# Altium schematic sheet mcu_node.SchDoc
size A3; SheetNumber: 2; SheetTotal: 2
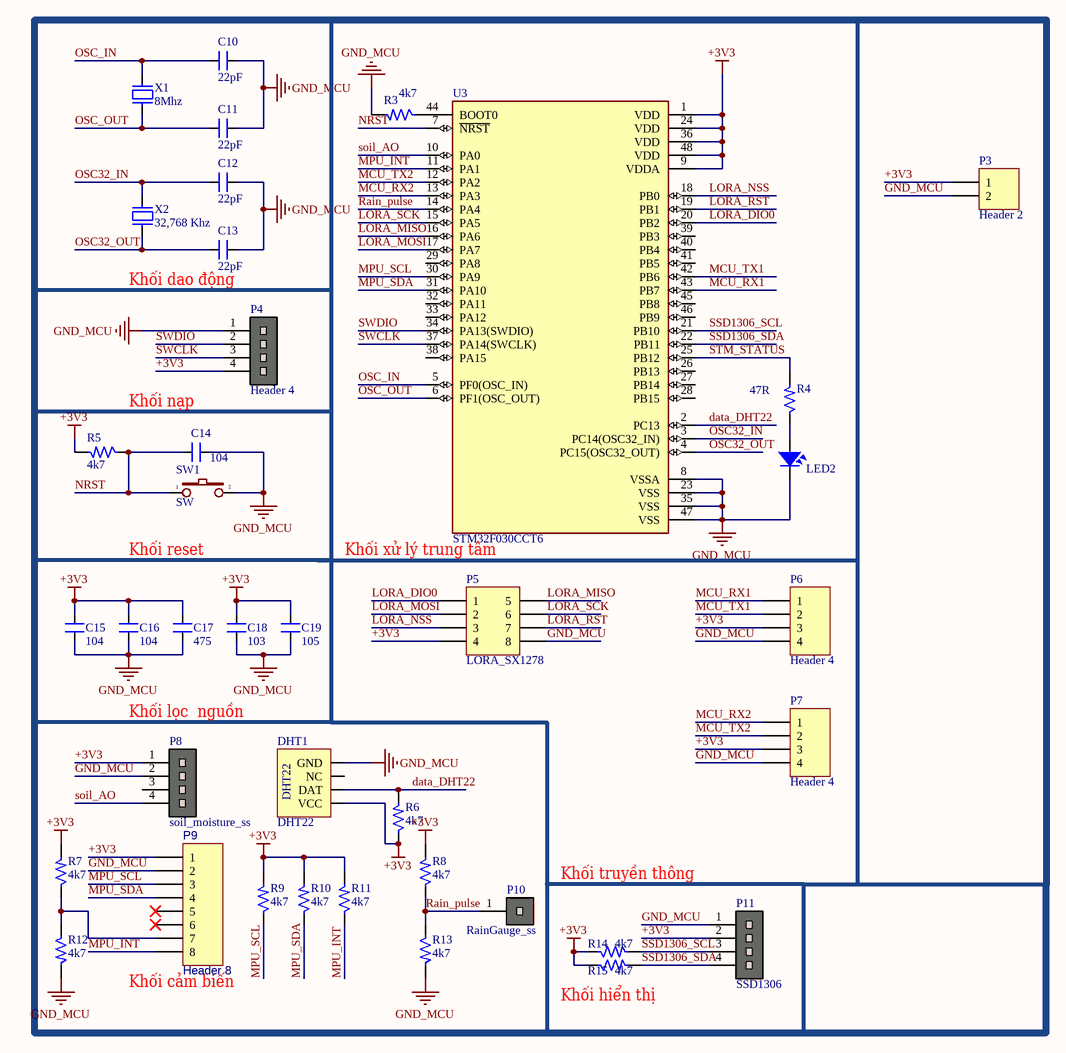
[diagram p0: mcu_node.SchDoc]

## Parts
C10  22pF  [SM-0805]
C11  22pF  [SM-0805]
C12  22pF  [SM-0805]
C13  22pF  [SM-0805]
C14  104  [SM-0805]
C15  104  [SM-0805]
C16  104  [SM-0805]
C17  475  [SM-0805]
C18  103  [SM-0805]
C19  105  [SM-0805]
DHT1  DHT22  [DHT22]
LED2  LED  [LED-0805-Green]  (value not drawn)
P3  Header 2  [HDR1X2]
P4  Header 4  [HDR 1X4]
P5  LORA_SX1278  [HDR2X4_CEN]
P6  Header 4  [HDR1X4]
P7  Header 4  [HDR1X4]
P8  soil_moisture_ss  [HDR 1X4]
P9  Header 8  [HDR1X8]
P10  RainGauge_ss  [HDR 1X1]
P11  SSD1306  [HDR 1X4]
R3  4k7  [R-0805]
R4  47R  [R-0805]
R5  4k7  [R-0805]
R6  4k7  [R-0805]
R7  4k7  [R-0805]
R8  4k7  [R-0805]
R9  4k7  [R-0805]
R10  4k7  [R-0805]
R11  4k7  [R-0805]
R12  4k7  [R-0805]
R13  4k7  [R-0805]
R14  4k7  [R-0805]
R15  4k7  [R-0805]
SW1  SW  [SW1-SMD]
U3  STM32F030CCT6  [QFP50P900X900X160-48N]
X1  8Mhz  [XT2]
X2  32,768 Khz  [XT32k]

## Nets
+3V3: C15.2 C16.2 C17.2 C18.2 C19.2 DHT1.1(VCC) P3.1 P4.4 P5.4 P6.3 P7.3 P8.1 P9.1 P11.2 R5.2 R6.1 R7.2 R8.2 R9.2 R10.2 R11.2 R14.1 R15.1 U3.1(VDD) U3.9(VDDA) U3.24(VDD) U3.36(VDD) U3.48(VDD)
GND_MCU: C10.1 C11.1 C12.1 C13.1 C14.2 C15.1 C16.1 C17.1 C18.1 C19.1 DHT1.4(GND) LED2.2 P3.2 P4.1 P5.8 P6.4 P7.4 P8.2 P9.2 P11.1 R3.2 R12.2 R13.2 SW1.2 U3.8(VSSA) U3.23(VSS) U3.35(VSS) U3.47(VSS)
data_DHT22: DHT1.2(DAT) R6.2 U3.2(PC13)
LORA_DIO0: P5.1 U3.20(PB2)
LORA_MISO: P5.5 U3.16(PA6)
LORA_MOSI: P5.2 U3.17(PA7)
LORA_NSS: P5.3 U3.18(PB0)
LORA_RST: P5.7 U3.19(PB1)
LORA_SCK: P5.6 U3.15(PA5)
MCU_RX1: P6.1 U3.43(PB7)
MCU_RX2: P7.1 U3.13(PA3)
MCU_TX1: P6.2 U3.42(PB6)
MCU_TX2: P7.2 U3.12(PA2)
MPU_INT: P9.8 R11.1 U3.11(PA1)
MPU_SCL: P9.3 R9.1 U3.30(PA9)
MPU_SDA: P9.4 R10.1 U3.31(PA10)
NRST: C14.1 R5.1 SW1.1 U3.7(~{NRST})
OSC32_IN: C12.2 U3.3(PC14(OSC32_IN)) X2.2
OSC32_OUT: C13.2 U3.4(PC15(OSC32_OUT)) X2.1
OSC_IN: C10.2 U3.5(PF0(OSC_IN)) X1.2
OSC_OUT: C11.2 U3.6(PF1(OSC_OUT)) X1.1
Rain_pulse: P10.1 R8.1 R13.1 U3.14(PA4)
soil_AO: P8.4 U3.10(PA0)
SSD1306_SCL: P11.3 R14.2 U3.21(PB10)
SSD1306_SDA: P11.4 R15.2 U3.22(PB11)
STM_STATUS: R4.2 U3.25(PB12)
SWCLK: P4.3 U3.37(PA14(SWCLK))
SWDIO: P4.2 U3.34(PA13(SWDIO))
NetLED2_1: LED2.1 R4.1
NetP9_7: P9.7 R7.1 R12.1
NetR3_1: R3.1 U3.44(BOOT0)

Not connected (* = marked no-connect by the designer): DHT1 3(NC); P8 3; P9 5* 6*; U3 26(PB13) 27(PB14) 28(PB15) 29(PA8) 32(PA11) 33(PA12) 38(PA15) 39(PB3) 40(PB4) 41(PB5) 45(PB8) 46(PB9)

## Notes on the sheet
- (near C13) Khối dao động
- Khối nạp
- Khối reset
- (near U3) Khối xử lý trung tâm
- (near P8) Khối lọc  nguồn
- Khối truyền thông
- (near P9) Khối cảm biến
- Khối hiển thị

## Library data of the parts
C10-C17 C19 = CM: Cap SMD; Value: 103
C18 = CM: Cap SMD; Value: 103
DHT1 = DHT22: Manufacturer: W¨¹rth Elektronik eiSos GmbH; partNo: 613004143121; ComponentLink1 Description: Manufacturer; ComponentLink2 Description: Datasheet; NoPins: 04; Created Date: 29 March 2013; ComponentLink1URL: http://www.we-online.com; ComponentLink2URL: http://katalog.we-online.de/em/datasheet/6130xx143121.pdf; Created by: Karrer Zheng
LED2 = LED SMD: Value: LED 3 - 5 ly 2 Colour
P3 = Header 2: Header, 2-Pin; LatestRevisionDate: 17-Jul-2002; LatestRevisionNote: Re-released for DXP Platform.; Publisher: Altium Limited
P4 P6-P8 P11 = Header 4: Header, 4-Pin
  P6 P7: LatestRevisionDate: 17-Jul-2002; LatestRevisionNote: Re-released for DXP Platform.; Publisher: Altium Limited
P5 = Header 4X2A: Header, 4-Pin, Dual row; LatestRevisionDate: 17-Jul-2002; LatestRevisionNote: Re-released for DXP Platform.; Publisher: Altium Limited
P9 = Header 8: Header, 8-Pin; LatestRevisionDate: 17-Jul-2002; LatestRevisionNote: Re-released for DXP Platform.; Publisher: Altium Limited
P10 = Header 1: Header, 1-Pin
R3-R15 = resistor: dien tro; value: 1k
SW1 = SW2: Switch button 2 pin; Value: SW chip 2 pin
U3 = STM32F030CCT6: ARMÂ® CortexÂ®-M0 STM32F0 Microcontroller IC 32-Bit 48MHz 256KB _256K x 8_ FLASH 48-LQFP _7x7_; MF: STMicroelectronics; Value: *; Digi-Key_Purchase_URL: https://www.digikey.com.ar/product-detail/en/stmicroelectronics/STM32F030CCT6TR/497-17332-2-ND/6833532?utm_source=snapeda&utm_medium=aggregator&utm_campaign=symbol; MP: STM32F030CCT6; Package: LQFP-48 STMicroelectronics; SnapEDA_Link: https://www.snapeda.com/parts/STM32F030CCT6/STMicroelectronics/view-part/447161/?ref=snap; Digi-Key_Part_Number: 497-17332-2-ND
X1 = XT2: Crystal For all Crystal 2pin.; Value: 4Mhz
X2 = XT32k: Crystal 32,768kHz for timer real; Value: 32,768khz